# EAGLE schematic shield (EAGLE 9.6.2)
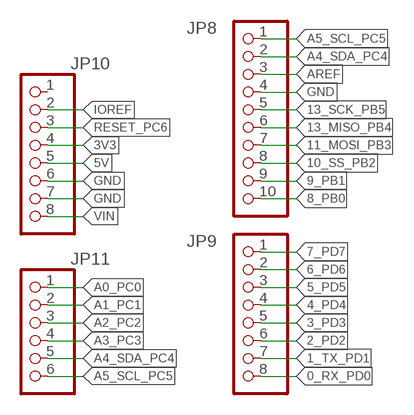
[diagram p0: schematic, sheet 1]

## Parts
JP8  PINHD-1X10  [1X10]
JP9  PINHD-1X8  [1X08]
JP10  PINHD-1X8  [1X08]
JP11  PINHD-1X6  [1X06]

## Nets
0_RX_PD0: JP9.8
1_TX_PD1: JP9.7
2_PD2: JP9.6
3_PD3: JP9.5
3V3: JP10.4
4_PD4: JP9.4
5_PD5: JP9.3
5V: JP10.5
6_PD6: JP9.2
7_PD7: JP9.1
8_PB0: JP8.10
9_PB1: JP8.9
10_SS_PB2: JP8.8
11_MOSI_PB3: JP8.7
13_MISO_PB4: JP8.6
13_SCK_PB5: JP8.5
A0_PC0: JP11.1
A1_PC1: JP11.2
A2_PC2: JP11.3
A3_PC3: JP11.4
A4_SDA_PC4: JP8.2 JP11.5
A5_SCL_PC5: JP8.1 JP11.6
AREF: JP8.3
GND: JP8.4 JP10.6 JP10.7
IOREF: JP10.2
RESET_PC6: JP10.3
VIN: JP10.8
Unconnected: JP10.1

## Library data of the parts
JP8 = pinhead:PINHD-1X10: PIN HEADER
JP9 JP10 = pinhead:PINHD-1X8: PIN HEADER
JP11 = pinhead:PINHD-1X6: PIN HEADER